# EAGLE design automatic light switch (EAGLE 9.6.2)
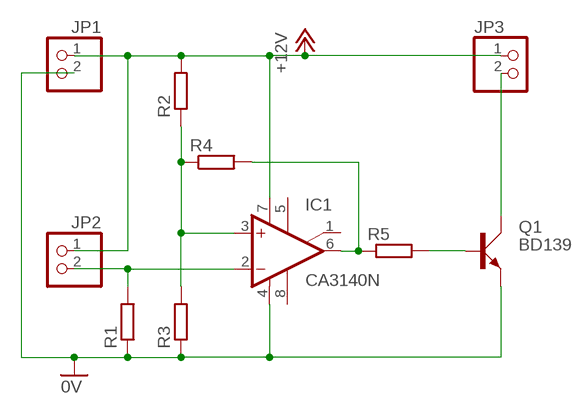
[diagram p0: schematic, sheet 1]

## Parts
IC1  CA3140N  [DIL08]
JP1  PINHD-1X2  [1X02]
JP2  PINHD-1X2  [1X02]
JP3  PINHD-1X2  [1X02]
Q1  BD139  [TO126AV]
R1  R-EU_0207/15  [0207/15]
R2  R-EU_0207/15  [0207/15]
R3  R-EU_0207/15  [0207/15]
R4  R-EU_0207/15  [0207/15]
R5  R-EU_0207/15  [0207/15]

## Nets
0V: IC1.4(V-) JP1.2 Q1.E R1.1 R3.1
+12V: IC1.7(V+) JP1.1 JP2.1 JP3.1 R2.2
N$2: IC1.2(-IN) JP2.2 R1.2
N$4: IC1.3(+IN) R2.1 R3.2 R4.1
N$5: IC1.6(OUT) R4.2 R5.1
N$6: Q1.B R5.2
N$7: JP3.2 Q1.C
Unconnected: IC1.1(ON/CMP) IC1.5(ON) IC1.8(CMP)

## Library data of the parts
IC1 = linear:CA3140: OP AMP
JP1-JP3 = pinhead:PINHD-1X2: PIN HEADER
Q1 = transistor-power:BD139: NPN TRANSISTOR
R1-R5 = rcl:R-EU_: RESISTOR, European symbol; SPICEPREFIX: R

## Board
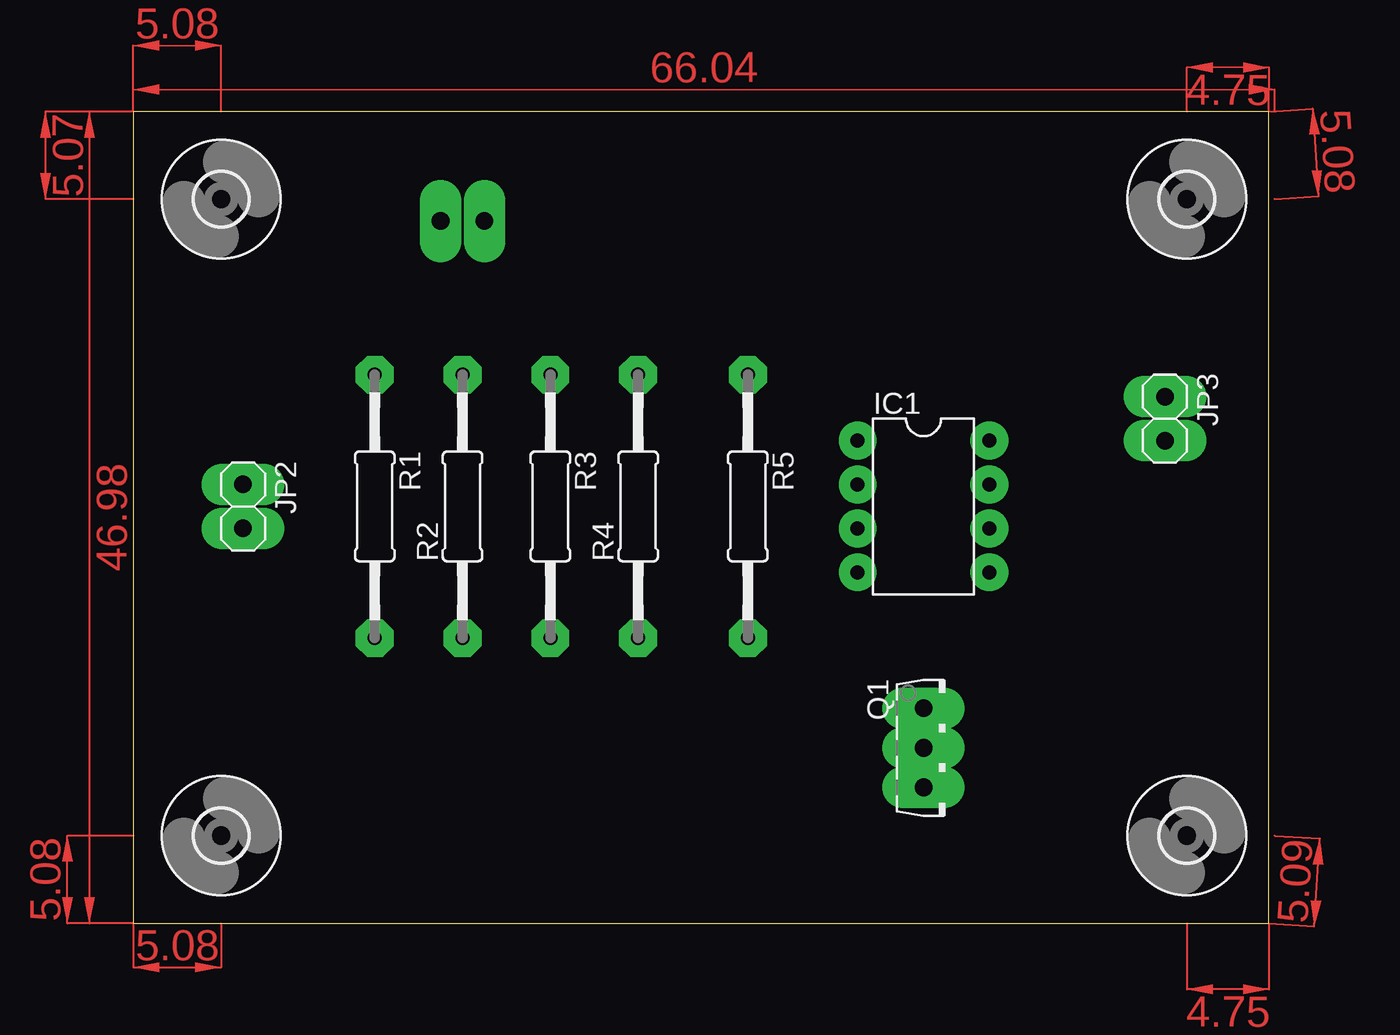
[diagram p1: board, top side]
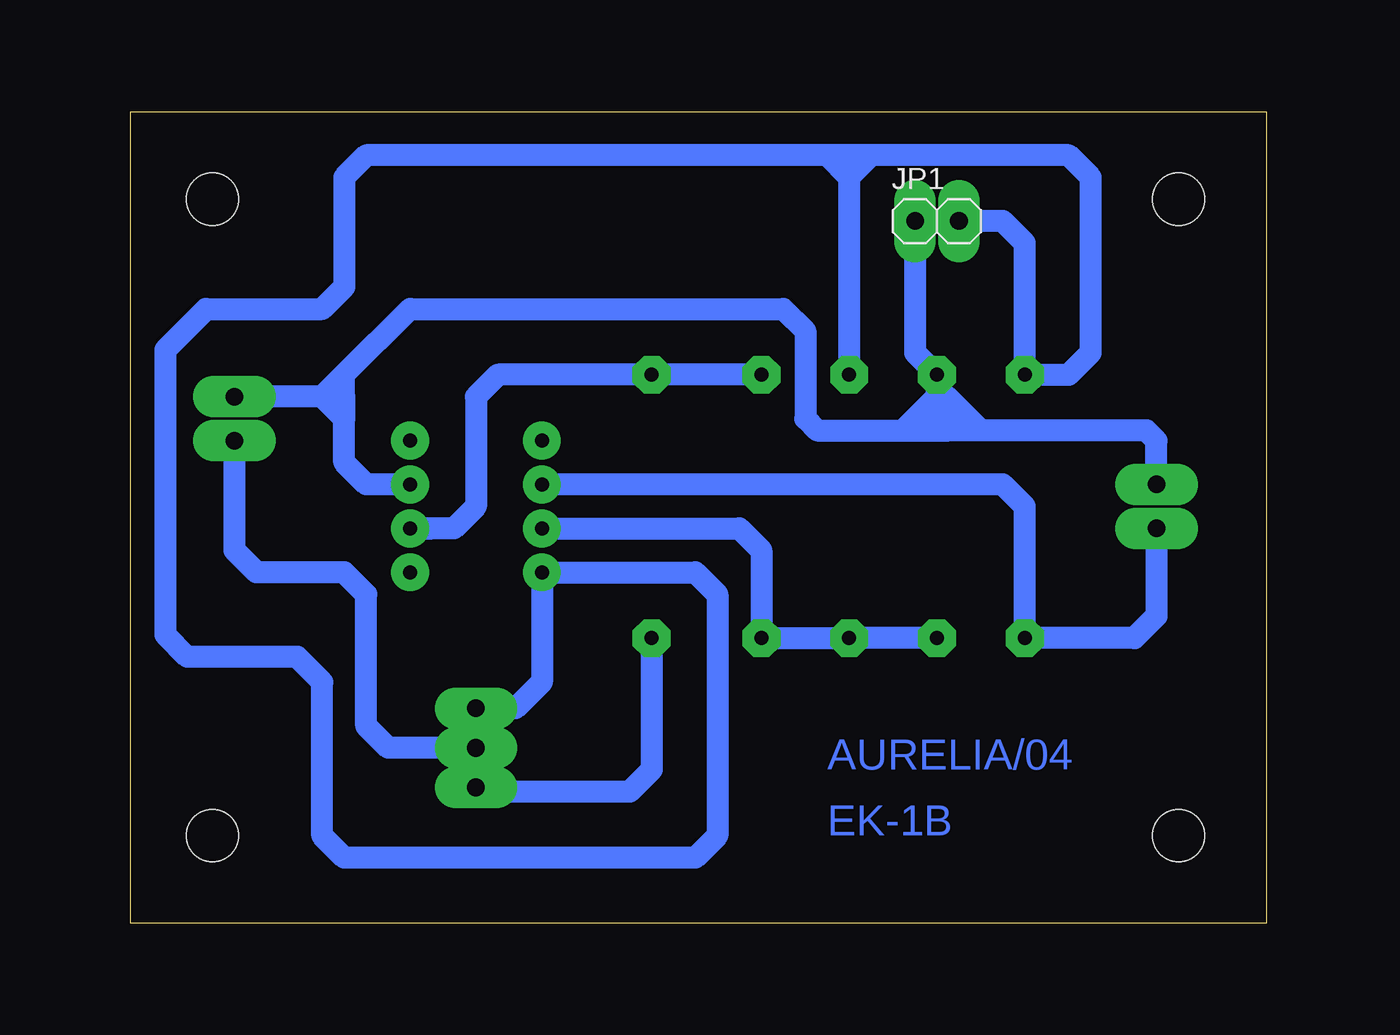
[diagram p2: board, bottom side, seen from below]

Size 65.71 x 46.98 mm. Coordinates in mm from the lower left corner, seen from the top.
Outline: 0,0 65.71,0 65.71,46.98 0,46.98 0,0
Copper layers (1*16): Top 0.035mm / dielectric 1.5mm / Bottom 0.035mm
Design rules "default *": minimum track width 6mil, minimum drill 0.35mm, track to track 6mil, track to pad 6mil, pad to pad 6mil, via to via 6mil, smd to smd 6mil, copper to edge 40mil, drill to drill 6mil, minimum pad ring 27mil, minimum via ring 10mil, stop-mask expansion 4mil, vias tented up to drill 0mil, thermal gap 10mil

### Footprints (pad centres in the part's own frame; a part is rotated, then mirrored left to right if it is on the bottom)
DIL08 = drill 0.813 pad 1.27: 1 -3.81,-3.81; 2 -1.27,-3.81; 3 1.27,-3.81; 4 3.81,-3.81; 5 3.81,3.81; 6 1.27,3.81; 7 -1.27,3.81; 8 -3.81,3.81
1X02 = drill 1.016 long: 1 -1.27,0; 2 1.27,0
TO126AV = drill 1.016 long: B 2.286,-1.27; C 0,-1.27; E -2.286,-1.27
0207/15 = drill 0.813 octagon: 1 -7.62,0; 2 7.62,0
3,0 = hole 3: 0,0

### Placement (x,y rotation side)
IC1  45.72,24.13 270 top
JP1  19.05,40.64 0 bottom
JP2  6.35,24.13 270 top
JP3  59.69,29.21 270 top
Q1  46.99,10.16 270 top
R1  13.97,24.13 270 top
R2  19.05,24.13 90 top
R3  24.13,24.13 270 top
R4  29.21,24.13 90 top
R5  35.56,24.13 270 top
U$1  [3,0]  60.96,41.91 0 top
U$2  [3,0]  60.96,5.08 0 top
U$3  [3,0]  5.08,5.08 0 top
U$4  [3,0]  5.08,41.91 0 top

### Tracks (layer width: path | path; a pad name or v marks a point on that pad's centre or on a via)
0V
  Bottom 1.27: 18.26,41.12 JP1.2 15.24,40.64 13.97,39.37 R1.1 11.43,31.75 10.16,33.02 10.16,43.18 11.43,44.45 22.86,44.45 | Q1.E 43.43,12.45 41.91,13.97 IC1.4 33.02,20.32 31.75,19.05 31.75,5.08 33.02,3.81 53.34,3.81 54.61,5.08 54.61,13.97 56.06,15.42 62.41,15.42 63.69,16.7 63.69,33.2 61.33,35.56 54.61,35.56 53.34,36.83 53.34,43.18 52.07,44.45 25.4,44.45 | 22.86,44.45 24.13,43.18 | 24.13,43.18 R3.1 | 24.13,43.18 25.4,44.45 | 22.86,44.45 25.4,44.45
+12V
  Bottom 0.152: 19.39,29.55 18.47,30.48 18.47,29.79 | 19.39,29.55 19.74,29.21 20.32,29.21 | 19.39,29.55 19.05,29.21 17.78,29.21
  Bottom 1.27: JP1.1 20.32,33.02 R2.2 19.05,30.48 | JP2.1 6.35,27.94 6.93,28.52 16.51,28.52 | 18.36,28.52 19.05,29.21 | 19.05,30.48 19.05,29.21 | 16.51,28.52 18.36,28.52 | 21.01,28.52 25.98,28.52 26.67,29.21 26.67,34.29 27.94,35.56 49.53,35.56 53.34,31.75 | 21.01,28.52 20.32,28.52 | 20.32,28.52 18.36,28.52 | IC1.7 52.07,25.4 53.34,26.67 53.34,29.21 | 53.34,29.21 53.98,29.84 | 53.98,29.84 54.61,30.48 | 54.61,30.48 JP3.1 | 54.61,30.48 53.34,30.48 | 53.34,30.48 53.34,31.75 | 53.98,29.84 53.34,30.48 | 53.34,30.48 53.34,29.21 | 53.34,31.75 54.61,30.48 | 19.05,30.48 20.32,29.21 | 20.32,29.21 20.32,28.52 | 20.32,29.21 21.01,28.52 | 16.51,28.52 18.47,30.48 19.05,30.48 | 19.05,29.21 18.47,29.79
N$2
  Bottom 1.27: JP2.2 6.35,17.78 7.62,16.51 R1.2 13.97,24.13 15.24,25.4 IC1.2
N$4
  Bottom 1.27: R2.1 R3.2 R4.1 29.21,21.59 30.48,22.86 IC1.3
N$5
  Bottom 1.27: R4.2 R5.1 44.45,31.75 45.72,30.48 45.72,24.13 46.99,22.86 IC1.6 48.26,22.86
N$6
  Bottom 1.27: R5.2 35.56,8.89 36.83,7.62 45.72,7.62 Q1.B
N$7
  Bottom 1.27: Q1.C 50.8,10.16 52.07,11.43 52.07,19.05 53.34,20.32 58.42,20.32 59.69,21.59 JP3.2
(copper drawn outside any net)
  shapes: Top area x10

### Text on the board
Bottom: AURELIA/04 | EK-1B